# EasyEDA schematic SCH_Rubber-Ducky_2026-02-24.json
TITLE: Sheet_1; REV: 1.0; Date: 2026-01-21; Sheet: 1/1; Drawn By: shaur1021; Company: Your Company
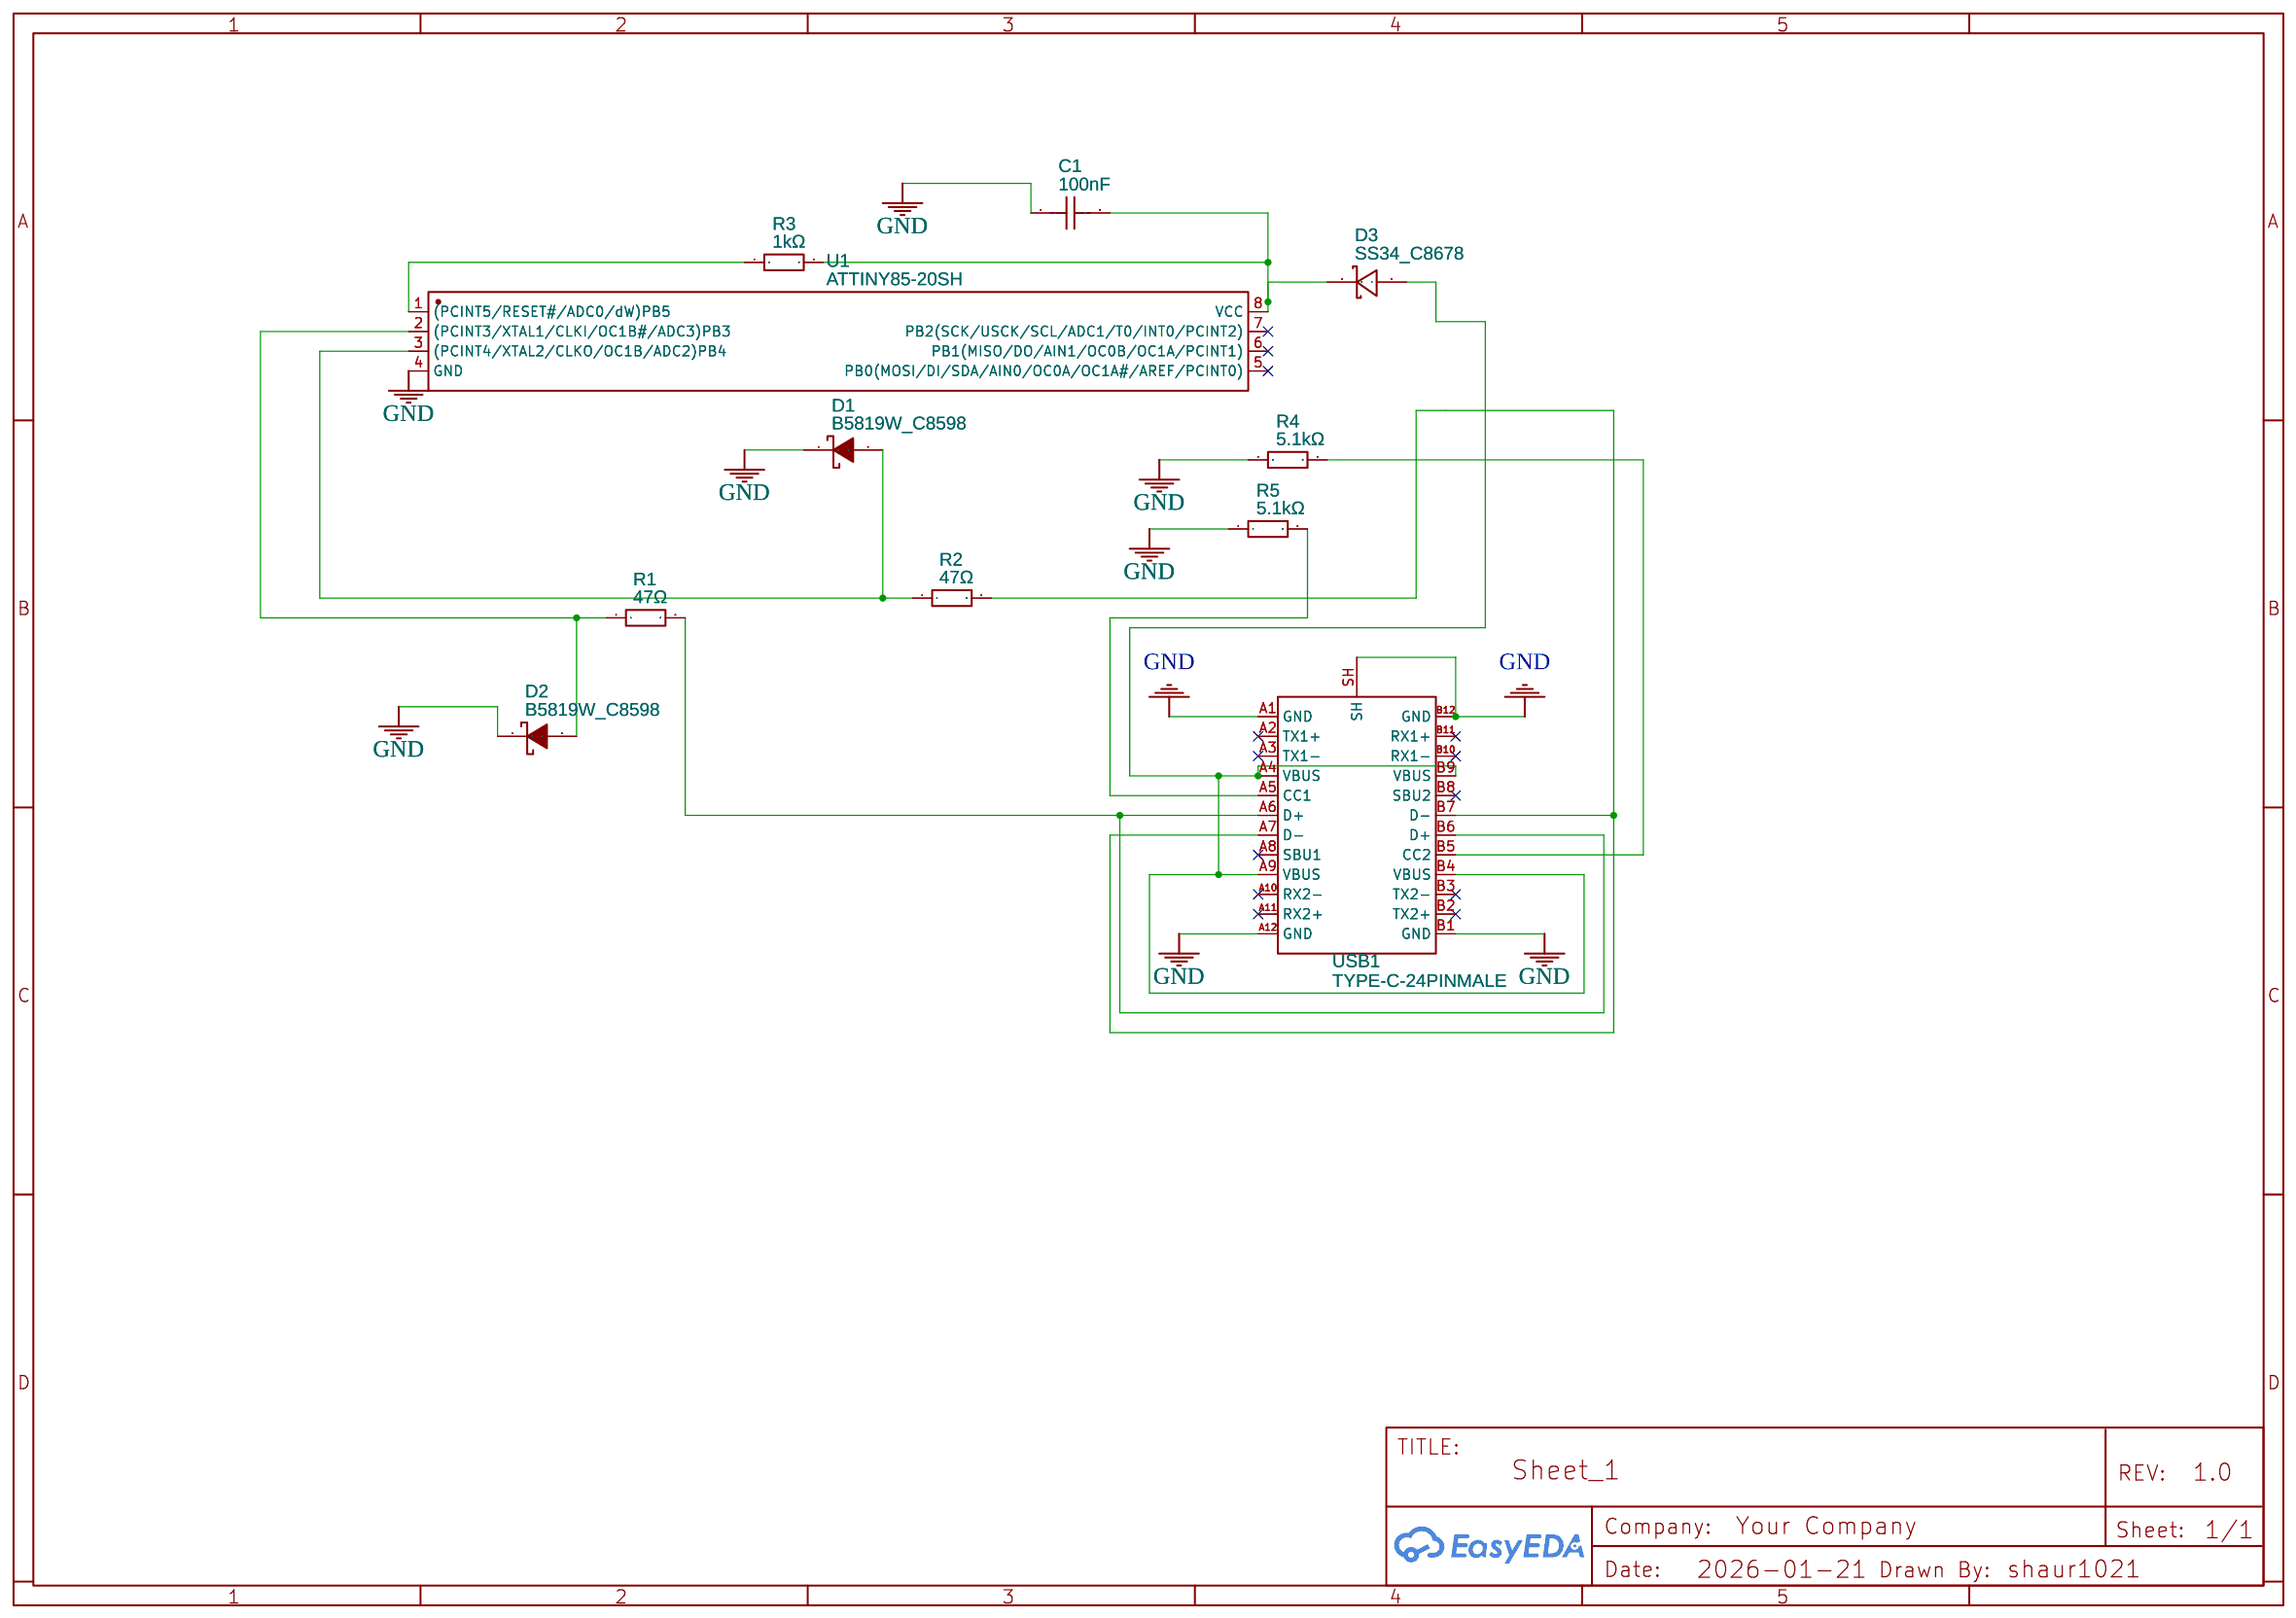
[diagram p0: schematic sheet]

## Parts
C1  100nF  [C0603]
D1  B5819W_C8598  [SOD-123_L2.7-W1.6-LS3.7-RD-1]
D2  B5819W_C8598  [SOD-123_L2.7-W1.6-LS3.7-RD-1]
D3  SS34_C8678  [SMA_L4.3-W2.6-LS5.2-RD]
R1  47Ω  [R0402]
R2  47Ω  [R0402]
R3  1kΩ  [R0603]
R4  5.1kΩ  [R0603]
R5  5.1kΩ  [R0603]
U1  ATTINY85-20SH  [SOIC-8_L4.9-W3.9-P1.27-LS6.0-BL]
USB1  TYPE-C-24PINMALE  [USB-TYPE-C-SMD_TYPE-C-24PINMALE]

## Library data of the parts
C1 = CC0603KRX7R9BB104: Supplier: LCSC; Manufacturer: YAGEO(国巨); Supplier Part: C14663; JLCPCB Part Class: Basic Part
D1 D2 = B5819W_C8598: Supplier: LCSC; Manufacturer: CJ(江苏长电/长晶); Manufacturer Part: B5819W SL; Supplier Part: C8598; JLCPCB Part Class: Basic Part
D3 = SS34_C8678: Supplier: LCSC; Manufacturer Part: SS34; Manufacturer: MDD(辰达半导体); Supplier Part: C8678; JLCPCB Part Class: Basic Part
R1 R2 = 0402WGF470JTCE: Supplier: LCSC; Manufacturer: UNI-ROYAL(厚声); Supplier Part: C25118; JLCPCB Part Class: Extended Part
R3 = 0603WAF1001T5E: Supplier: LCSC; Manufacturer: UNI-ROYAL(厚声); Supplier Part: C21190; JLCPCB Part Class: Basic Part
R4 R5 = 0603WAF5101T5E: Supplier: LCSC; Manufacturer: UNI-ROYAL(厚声); Supplier Part: C23186; JLCPCB Part Class: Basic Part
U1 = ATTINY85-20SH: Contributor: LCSC; Supplier: LCSC; Supplier Part: C1339831; Manufacturer: MICROCHIP(美国微芯); JLCPCB Part Class: Extended Part
USB1 = TYPE-C-24PINMALE: Contributor: LCSC; Supplier: LCSC; Supplier Part: C9900001841; Manufacturer: null; JLCPCB Part Class: Extended Part

## Nets
GND: C1.1 D1.1(-) D2.1(-) R4.1 R5.1 U1.4(GND) USB1.A1(GND) USB1.A12(GND) USB1.B1(GND) USB1.B12(GND) USB1.SH
Net-(C1-2): C1.2 D3.1(K) R3.2 U1.8(VCC)
Net-(D1-2): D1.2(+) R2.1 U1.3((PCINT4/XTAL2/CLKO/OC1B/ADC2)PB4)
Net-(D2-2): D2.2(+) R1.1 U1.2((PCINT3/XTAL1/CLKI/OC1B#/ADC3)PB3)
Net-(D3-2): D3.2(A) USB1.A4(VBUS) USB1.A9(VBUS) USB1.B4(VBUS) USB1.B9(VBUS)
Net-(R1-2): R1.2 USB1.A6(D+) USB1.B6(D+)
Net-(R2-2): R2.2 USB1.A7(D-) USB1.B7(D-)
Net-(R3-1): R3.1 U1.1((PCINT5/RESET#/ADC0/dW)PB5)
Net-(R4-2): R4.2 USB1.B5(CC2)
Net-(R5-2): R5.2 USB1.A5(CC1)

Not connected (* = marked no-connect by the designer): U1 5(PB0(MOSI/DI/SDA/AIN0/OC0A/OC1A#/AREF/PCINT0))* 6(PB1(MISO/DO/AIN1/OC0B/OC1A/PCINT1))* 7(PB2(SCK/USCK/SCL/ADC1/T0/INT0/PCINT2))*; USB1 A2(TX1+)* A3(TX1-)* A8(SBU1)* A10(RX2-)* A11(RX2+)* B2(TX2+)* B3(TX2-)* B8(SBU2)* B10(RX1-)* B11(RX1+)*
